# Altium schematic sheet Power.SchDoc
size A4
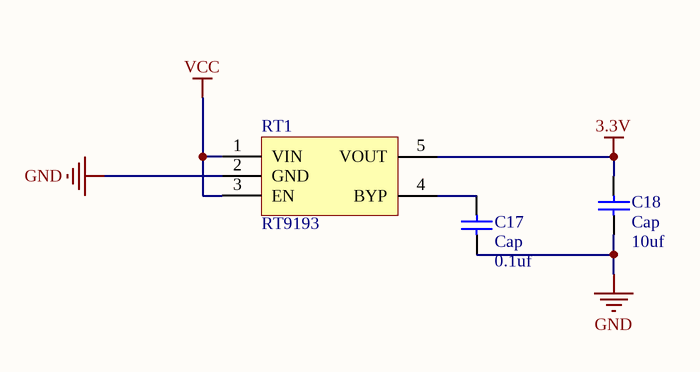
[diagram p0: Power.SchDoc]

## Parts
C17  Cap  value 0.1uf  [CAP_0402]
C18  Cap  value 10uf  [CAP_0603]
RT1  RT9193  [SOT23-5L]

## Nets
3.3V: C18.2 RT1.5(VOUT)
GND: C17.1 C18.1 RT1.2(GND)
VCC: RT1.1(VIN) RT1.3(EN)
NetC17_2: C17.2 RT1.4(BYP)

## Library data of the parts
C17 C18 = Cap: Capacitor; Published: 8-Jun-2000; LatestRevisionDate: 17-Jul-2002; LatestRevisionNote: Re-released for DXP Platform.; PackageReference: RAD-0.3; Publisher: Altium Limited; PackageDescription: Radial Cap, Thru-Hole; 2 Leads; 0.3 in Pin Spacing
RT1 = RT9193: Power